# Altium schematic sheet HomeLight_230722.SchDoc
size A3
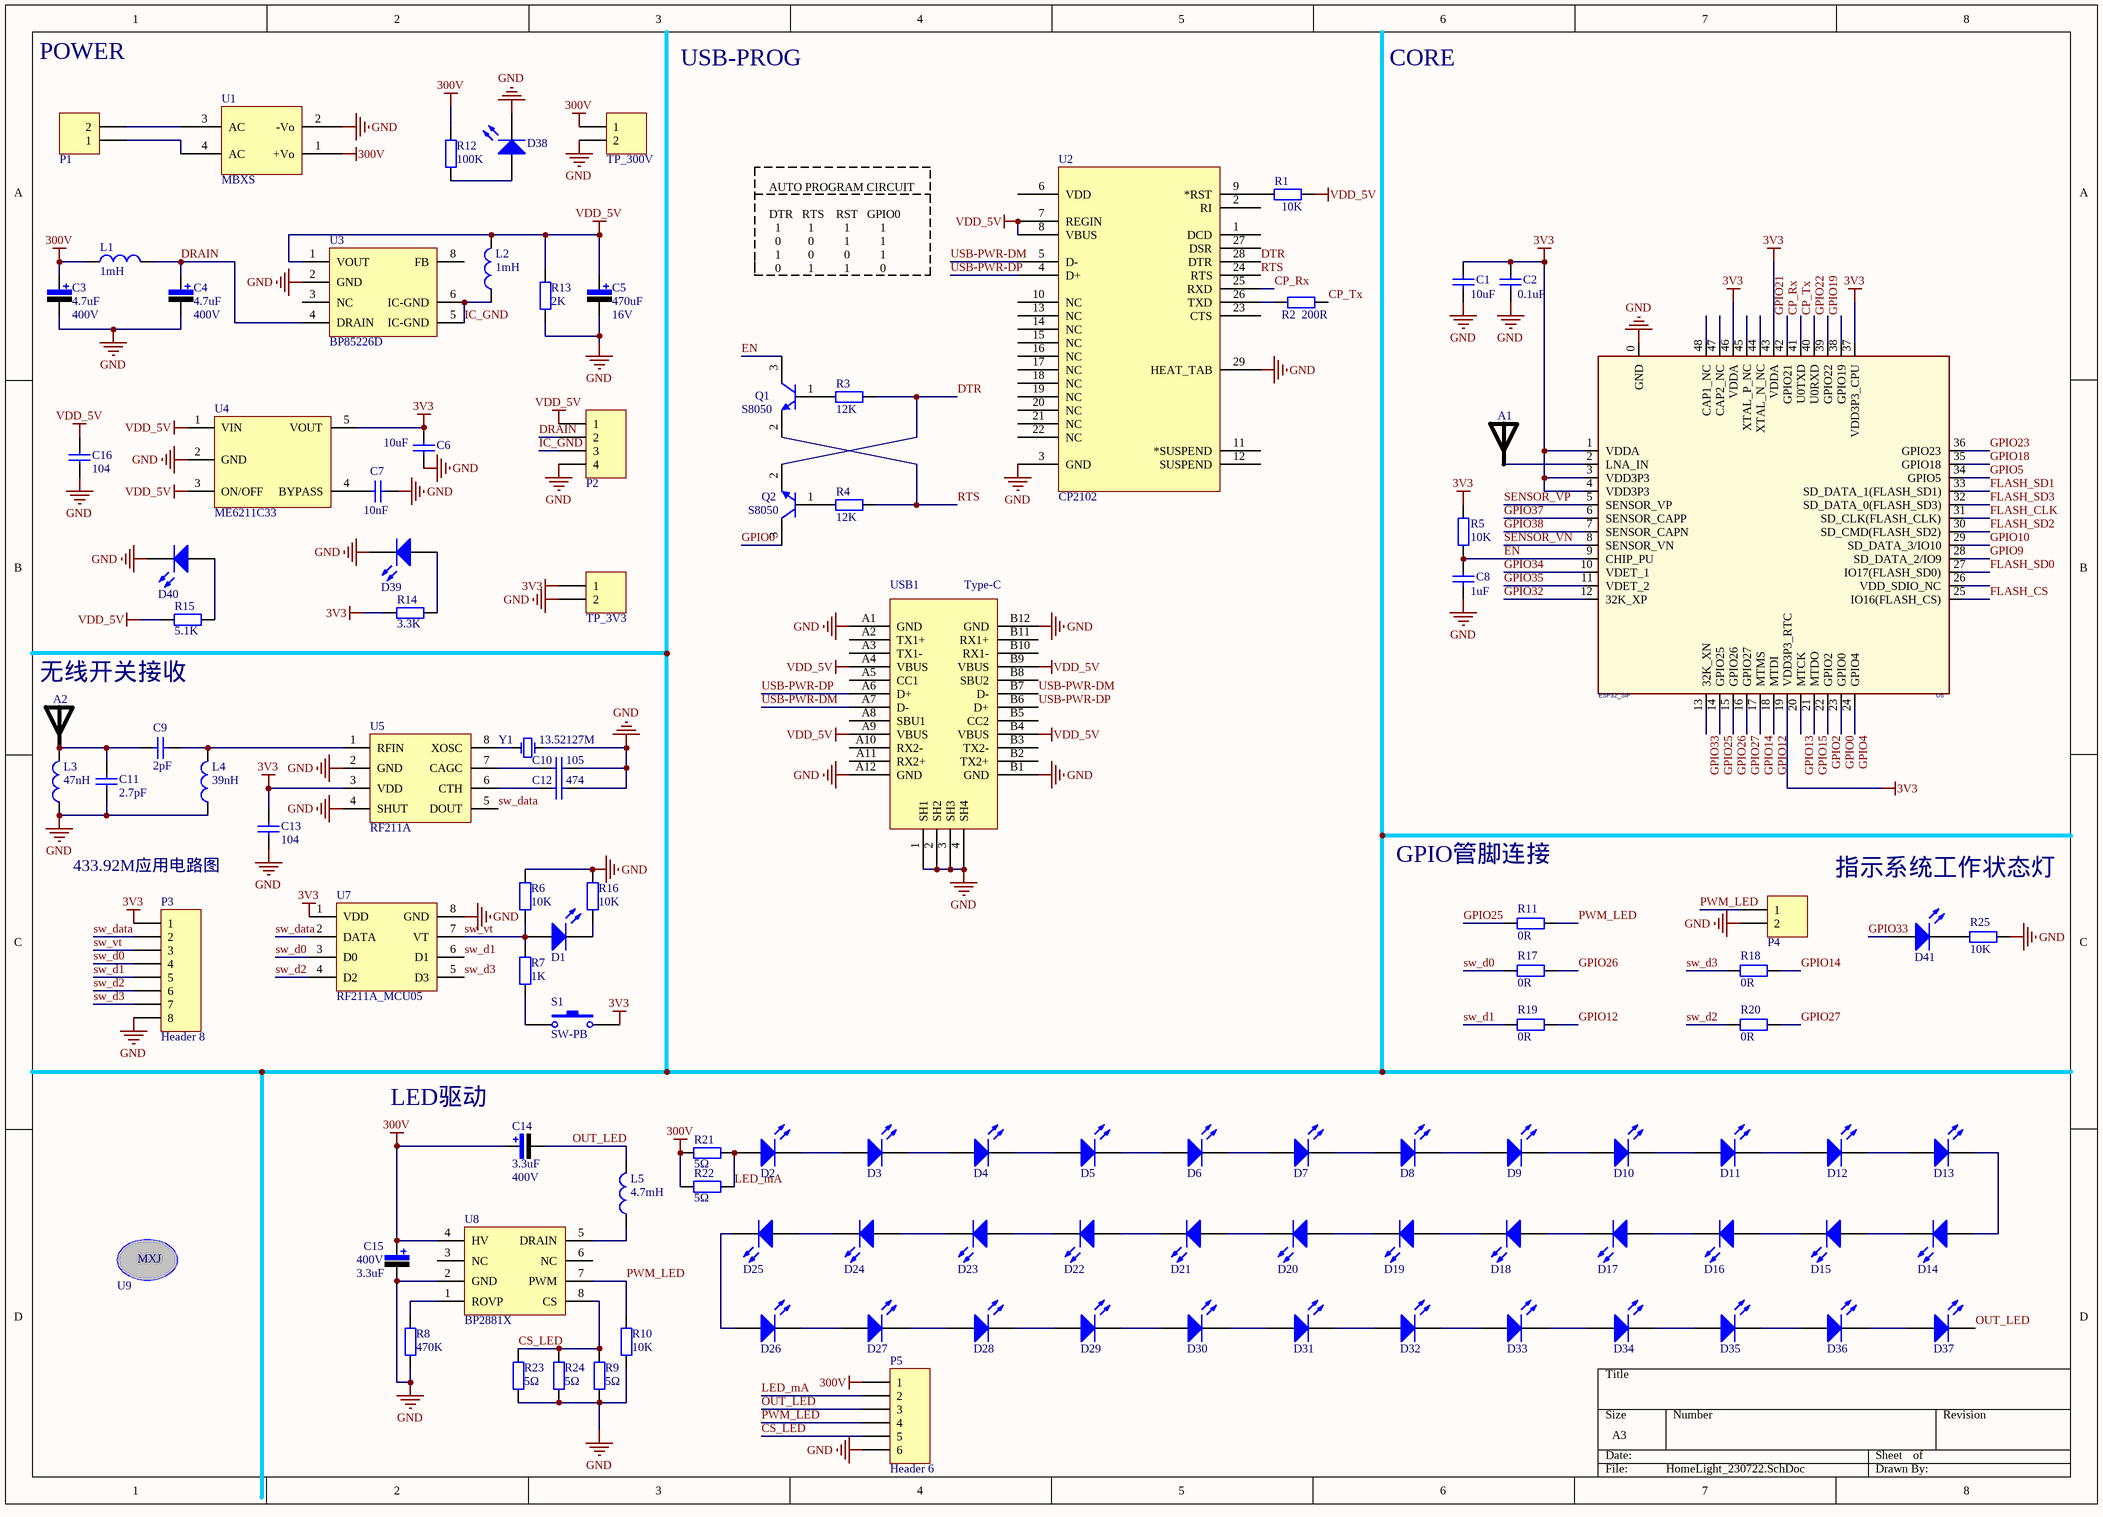
[diagram p0: HomeLight_230722.SchDoc]

## Parts
A1  ANT  [ANT5020R2400]  (value not drawn)
A2  ANT  [ANT15030R433]  (value not drawn)
C1  10uF  [0603-2]
C2  0.1uF  [0603-2]
C3  value 4.7uF  Vol: 400V  [SMD-EC-F8]  (hidden comment: Cap Pol)
C4  value 4.7uF  Vol: 400V  [SMD-EC-F8]  (hidden comment: Cap Pol)
C5  value 470uF  Vol: 16V  [SMD-EC-F8]  (hidden comment: Cap Pol)
C6  10uF  [0603-2]
C7  10nF  [0603-2]
C8  1uF  [0603-2]
C9  value 2pF  [0603-2]  (hidden comment: Cap)
C10  value 105  [0603-2]  (hidden comment: Cap)
C11  value 2.7pF  [0603-2]  (hidden comment: Cap)
C12  value 474  [0603-2]  (hidden comment: Cap)
C13  value 104  [0603-2]  (hidden comment: Cap)
C14  value 3.3uF  Vol: 400V  [SMD-EC-F8]  (hidden comment: Cap Pol)
C15  value 3.3uF  Vol: 400V  [SMD-EC-F8]  (hidden comment: Cap Pol)
C16  value 104  [0603-2]  (hidden comment: Cap)
D1  LED0  [LED_0603]  (value not drawn)
D2  LED0  [LED-5730]  (value not drawn)
D3  LED0  [LED-5730]  (value not drawn)
D4  LED0  [LED-5730]  (value not drawn)
D5  LED0  [LED-5730]  (value not drawn)
D6  LED0  [LED-5730]  (value not drawn)
D7  LED0  [LED-5730]  (value not drawn)
D8  LED0  [LED-5730]  (value not drawn)
D9  LED0  [LED-5730]  (value not drawn)
D10  LED0  [LED-5730]  (value not drawn)
D11  LED0  [LED-5730]  (value not drawn)
D12  LED0  [LED-5730]  (value not drawn)
D13  LED0  [LED-5730]  (value not drawn)
D14  LED0  [LED-5730]  (value not drawn)
D15  LED0  [LED-5730]  (value not drawn)
D16  LED0  [LED-5730]  (value not drawn)
D17  LED0  [LED-5730]  (value not drawn)
D18  LED0  [LED-5730]  (value not drawn)
D19  LED0  [LED-5730]  (value not drawn)
D20  LED0  [LED-5730]  (value not drawn)
D21  LED0  [LED-5730]  (value not drawn)
D22  LED0  [LED-5730]  (value not drawn)
D23  LED0  [LED-5730]  (value not drawn)
D24  LED0  [LED-5730]  (value not drawn)
D25  LED0  [LED-5730]  (value not drawn)
D26  LED0  [LED-5730]  (value not drawn)
D27  LED0  [LED-5730]  (value not drawn)
D28  LED0  [LED-5730]  (value not drawn)
D29  LED0  [LED-5730]  (value not drawn)
D30  LED0  [LED-5730]  (value not drawn)
D31  LED0  [LED-5730]  (value not drawn)
D32  LED0  [LED-5730]  (value not drawn)
D33  LED0  [LED-5730]  (value not drawn)
D34  LED0  [LED-5730]  (value not drawn)
D35  LED0  [LED-5730]  (value not drawn)
D36  LED0  [LED-5730]  (value not drawn)
D37  LED0  [LED-5730]  (value not drawn)
D38  LED0  [LED_0603]  (value not drawn)
D39  LED0  [LED_0603]  (value not drawn)
D40  LED0  [LED_0603]  (value not drawn)
D41  LED0  [LED_0603]  (value not drawn)
L1  value 1mH  [CD54]  (hidden comment: Inductor)
L2  value 1mH  [CD54]  (hidden comment: Inductor)
L3  value 47nH  [0603-1]  (hidden comment: Inductor)
L4  value 39nH  [0603-1]  (hidden comment: Inductor)
L5  value 4.7mH  [CD54]  (hidden comment: Inductor)
P1  Header 2  [HDR2X1_焊接版]  (value not drawn)
P2  Header 4  [HDR4X1_2.54]  (value not drawn)
P3  Header 8  [HDR8X1_2.54]
P4  Header 2  [HDR2X1_2.54]  (value not drawn)
P5  Header 6  [HDR6X1_2.54]
Q1  S8050  [SOT-23]
Q2  S8050  [SOT-23]
R1  10K  [0603-1]
R2  200R  [0603-1]
R3  12K  [0603-1]
R4  12K  [0603-1]
R5  10K  [0603-1]
R6  value 10K  [0603-1]  (hidden comment: Res1)
R7  value 1K  [0603-1]  (hidden comment: Res1)
R8  value 470K  [0603-1]  (hidden comment: Res1)
R9  value 5Ω  [0603-1]  (hidden comment: Res1)
R10  value 10K  [0603-1]  (hidden comment: Res1)
R11  value 0R  [0603-1]  (hidden comment: Res1)
R12  value 100K  [0603-1]  (hidden comment: 12K)
R13  value 2K  [0603-1]  (hidden comment: 12K)
R14  value 3.3K  [0603-1]  (hidden comment: 12K)
R15  value 5.1K  [0603-1]  (hidden comment: 12K)
R16  value 10K  [0603-1]  (hidden comment: Res1)
R17  value 0R  [0603-1]  (hidden comment: Res1)
R18  value 0R  [0603-1]  (hidden comment: Res1)
R19  value 0R  [0603-1]  (hidden comment: Res1)
R20  value 0R  [0603-1]  (hidden comment: Res1)
R21  value 5Ω  [0603-1]  (hidden comment: Res1)
R22  value 5Ω  [0603-1]  (hidden comment: Res1)
R23  value 5Ω  [0603-1]  (hidden comment: Res1)
R24  value 5Ω  [0603-1]  (hidden comment: Res1)
R25  value 10K  [0603-1]  (hidden comment: Res1)
S1  SW-PB  [SW_PB2_A1]
TP_3V3  Header 2  [HDR2X1_2.54]  (value not drawn)
TP_300V  Header 2  [HDR2X1_2.54]  (value not drawn)
U1  MBXS  [MBXS]
U2  CP2102  [QFN-28]
U3  BP85226D  [BP85226-BP2881]
U4  ME6211C33  [SOT23-5]
U5  RF211A  [SOIC-8]
U6  ESP32_SIP  [QFN-48_7X7]
U7  RF211A_MCU05  [SOIC-8]
U8  BP2881X  [BP85226-BP2881]
U9  logo_MXJ  [logo_MXJ]  (value not drawn)
USB1  Type-C  [Type-C-TOP]
Y1  value 13.52127M  [X-SM49]  (hidden comment: XTAL)

## Nets
3V3: C1.2 C2.2 C6.2 C13.1 P3.1 R5.1 R14.2 S1.2 TP_3V3.1 U4.5(VOUT) U5.3(VDD) U6.1(VDDA) U6.3(VDD3P3) U6.4(VDD3P3) U6.19(VDD3P3_RTC) U6.37(VDD3P3_CPU) U6.43(VDDA) U6.46(VDDA) U7.1(VDD)
300V: C3.1 C14.1 C15.1 L1.1 P5.1 R12.2 R21.2 R22.2 TP_300V.1 U1.1(+Vo) U8.4(HV)
GND: C1.1 C2.1 C3.2 C4.2 C5.2 C6.1 C7.1 C8.2 C10.1 C11.2 C12.1 C13.2 C15.2 C16.2 D38.2(K) D39.2(K) D40.2(K) L3.1 L4.1 P2.4 P3.8 P4.2 P5.6 R6.2 R8.1 R9.1 R10.1 R13.2 R16.2 R23.1 R24.1 R25.1 TP_3V3.2 TP_300V.2 U1.2(-Vo) U2.3(GND) U2.29(HEAT_TAB) U3.2(GND) U4.2(GND) U5.2(GND) U5.4(SHUT) U6.0(GND) U7.8(GND) U8.2(GND) USB1.1(SH1) USB1.2(SH2) USB1.3(SH3) USB1.4(SH4) USB1.A1(GND) USB1.A12(GND) USB1.B1(GND) USB1.B12(GND) Y1.2
VDD_5V: C5.1 C16.1 L2.2 P2.1 R1.1 R13.1 R15.2 U2.7(REGIN) U2.8(VBUS) U3.1(VOUT) U4.1(VIN) U4.3(ON/OFF) USB1.A4(VBUS) USB1.A9(VBUS) USB1.B4(VBUS) USB1.B9(VBUS)
CP_Rx: U2.25(RXD) U6.41(U0TXD)
CP_Tx: R2.1 U6.40(U0RXD)
CS_LED: P5.5 R9.2 R23.2 R24.2 U8.8(CS)
DRAIN: C4.1 L1.2 P2.2 U3.4(DRAIN)
DTR: Q2.2(E) R3.1 U2.28(DTR)
EN: C8.1 Q1.3(C) R5.2 U6.9(CHIP_PU)
FLASH_CLK: U6.31(SD_CLK(FLASH_CLK))
FLASH_CS: U6.25(IO16(FLASH_CS))
FLASH_SD0: U6.27(IO17(FLASH_SD0))
FLASH_SD1: U6.33(SD_DATA_1(FLASH_SD1))
FLASH_SD2: U6.30(SD_CMD(FLASH_SD2))
FLASH_SD3: U6.32(SD_DATA_0(FLASH_SD3))
GPIO0: Q2.3(C) U6.23(GPIO0)
GPIO2: U6.22(GPIO2)
GPIO4: U6.24(GPIO4)
GPIO5: U6.34(GPIO5)
GPIO9: U6.28(SD_DATA_2/IO9)
GPIO10: U6.29(SD_DATA_3/IO10)
GPIO12: R19.1 U6.18(MTDI)
GPIO13: U6.20(MTCK)
GPIO14: R18.1 U6.17(MTMS)
GPIO15: U6.21(MTDO)
GPIO18: U6.35(GPIO18)
GPIO19: U6.38(GPIO19)
GPIO21: U6.42(GPIO21)
GPIO22: U6.39(GPIO22)
GPIO23: U6.36(GPIO23)
GPIO25: R11.2 U6.14(GPIO25)
GPIO26: R17.1 U6.15(GPIO26)
GPIO27: R20.1 U6.16(GPIO27)
GPIO32: U6.12(32K_XP)
GPIO33: D41.1(A) U6.13(32K_XN)
GPIO34: U6.10(VDET_1)
GPIO35: U6.11(VDET_2)
GPIO37: U6.6(SENSOR_CAPP)
GPIO38: U6.7(SENSOR_CAPN)
IC_GND: L2.1 P2.3 U3.5(IC-GND) U3.6(IC-GND)
LED_mA: D2.1(A) P5.2 R21.1 R22.1
OUT_LED: C14.2 D37.2(K) L5.2 P5.3
PWM_LED: P4.1 P5.4 R10.2 R11.1 U8.7(PWM)
RTS: Q1.2(E) R4.1 U2.24(RTS)
SENSOR_VN: U6.8(SENSOR_VN)
SENSOR_VP: U6.5(SENSOR_VP)
sw_d0: P3.4 R17.2 U7.3(D0)
sw_d1: P3.5 R19.2 U7.6(D1)
sw_d2: P3.6 R20.2 U7.4(D2)
sw_d3: P3.7 R18.2 U7.5(D3)
sw_data: P3.2 U5.5(DOUT) U7.2(DATA)
sw_vt: D1.1(A) P3.3 R6.1 R7.2 U7.7(VT)
USB-PWR-DM: U2.5(D-) USB1.A7(D-) USB1.B7(D-)
USB-PWR-DP: U2.4(D+) USB1.A6(D+) USB1.B6(D+)
NetA1_1: A1.1 U6.2(LNA_IN)
NetA2_1: A2.1 C9.1 C11.1 L3.2
NetC7_2: C7.2 U4.4(BYPASS)
NetC9_2: C9.2 L4.2 U5.1(RFIN)
NetC10_2: C10.2 U5.7(CAGC)
NetC12_2: C12.2 U5.6(CTH)
NetD1_2: D1.2(K) R16.1
NetD2_2: D2.2(K) D3.1(A)
NetD3_2: D3.2(K) D4.1(A)
NetD4_2: D4.2(K) D5.1(A)
NetD5_2: D5.2(K) D6.1(A)
NetD6_2: D6.2(K) D7.1(A)
NetD7_2: D7.2(K) D8.1(A)
NetD8_2: D8.2(K) D9.1(A)
NetD9_2: D9.2(K) D10.1(A)
NetD10_2: D10.2(K) D11.1(A)
NetD11_2: D11.2(K) D12.1(A)
NetD12_2: D12.2(K) D13.1(A)
NetD13_2: D13.2(K) D14.1(A)
NetD14_2: D14.2(K) D15.1(A)
NetD15_2: D15.2(K) D16.1(A)
NetD16_2: D16.2(K) D17.1(A)
NetD17_2: D17.2(K) D18.1(A)
NetD18_2: D18.2(K) D19.1(A)
NetD19_2: D19.2(K) D20.1(A)
NetD20_2: D20.2(K) D21.1(A)
NetD21_2: D21.2(K) D22.1(A)
NetD22_2: D22.2(K) D23.1(A)
NetD23_2: D23.2(K) D24.1(A)
NetD24_2: D24.2(K) D25.1(A)
NetD25_2: D25.2(K) D26.1(A)
NetD26_2: D26.2(K) D27.1(A)
NetD27_2: D27.2(K) D28.1(A)
NetD28_2: D28.2(K) D29.1(A)
NetD29_2: D29.2(K) D30.1(A)
NetD30_2: D30.2(K) D31.1(A)
NetD31_2: D31.2(K) D32.1(A)
NetD32_2: D32.2(K) D33.1(A)
NetD33_2: D33.2(K) D34.1(A)
NetD34_2: D34.2(K) D35.1(A)
NetD35_2: D35.2(K) D36.1(A)
NetD36_2: D36.2(K) D37.1(A)
NetD38_1: D38.1(A) R12.1
NetD39_1: D39.1(A) R14.1
NetD40_1: D40.1(A) R15.1
NetD41_2: D41.2(K) R25.2
NetL5_1: L5.1 U8.5(DRAIN)
NetP1_1: P1.1 U1.4(AC)
NetP1_2: P1.2 U1.3(AC)
NetQ1_1: Q1.1(B) R3.2
NetQ2_1: Q2.1(B) R4.2
NetR1_2: R1.2 U2.9(*RST)
NetR2_2: R2.2 U2.26(TXD)
NetR7_1: R7.1 S1.1
NetR8_2: R8.2 U8.1(ROVP)
NetU5_8: U5.8(XOSC) Y1.1

Not connected (* = marked no-connect by the designer): U2 1(DCD) 2(RI) 6(VDD) 10(NC) 11(*SUSPEND) 12(SUSPEND) 13(NC) 14(NC) 15(NC) 16(NC) 17(NC) 18(NC) 19(NC) 20(NC) 21(NC) 22(NC) 23(CTS) 27(DSR); U3 3(NC) 8(FB); U6 26(VDD_SDIO_NC) 44(XTAL_N_NC) 45(XTAL_P_NC) 47(CAP2_NC) 48(CAP1_NC); U8 3(NC) 6(NC); USB1 A2(TX1+) A3(TX1-) A5(CC1) A8(SBU1) A10(RX2-) A11(RX2+) B2(TX2+) B3(TX2-) B5(CC2) B8(SBU2) B10(RX1-) B11(RX1+)

## Notes on the sheet
- POWER
- USB-PROG
- CORE
- AUTO PROGRAM CIRCUIT
  DTR   RTS    RST   GPIO0
  1         1          1          1
  0         0          1          1
  1         0          0          1
  0         1          1          0
- 无线开关接收
- 433.92M应用电路图
- GPIO管脚连接
- 指示系统工作状态灯
- LED驱动
- (in symbol logo_MXJ) MXJ

## Library data of the parts
C1 C2 C6-C13 C16 = Cap: 无极性电容; Published: 8-Jun-2000; LatestRevisionDate: 17-Jul-2002; LatestRevisionNote: Re-released for DXP Platform.; PackageReference: RAD-0.3; Publisher: Altium Limited
  C1 C6: Value: 10uF
  C2: Value: 0.1uF
  C7: Value: 10nF
  C8: Value: 1uF
C3-C5 C14 C15 = Cap Pol: 极性电解电容; Published: 8-Jun-2000; LatestRevisionDate: 17-Jul-2002; LatestRevisionNote: Re-released for DXP Platform.; PackageReference: RB7.6-15; Publisher: Altium Limited
D1-D41 = LED0: 发光二极管; Published: 8-Jun-2000; LatestRevisionDate: 08-Jul-2005; LatestRevisionNote: Mech Layer 1 removed.; PackageReference: LED-0; Publisher: Altium Limited
L1-L5 = Inductor: 电感; Code_IEC: 1005; Published: 8-Jun-2000; LatestRevisionDate: 17-Jul-2002; LatestRevisionNote: Re-released for DXP Platform.; PackageReference: 0402-A; Publisher: Altium Limited; Code_JEITA: 0402
P1 P4 TP_3V3 TP_300V = Header 2: 接插件; LatestRevisionDate: 17-Jul-2002; LatestRevisionNote: Re-released for DXP Platform.; Publisher: Altium Limited
P2 = Header 4: 接插件; LatestRevisionDate: 17-Jul-2002; LatestRevisionNote: Re-released for DXP Platform.; Publisher: Altium Limited
P3 = Header 8: Header, 8-Pin; LatestRevisionDate: 17-Jul-2002; LatestRevisionNote: Re-released for DXP Platform.; Publisher: Altium Limited
P5 = Header 6: 接插件; LatestRevisionDate: 17-Jul-2002; LatestRevisionNote: Re-released for DXP Platform.; Publisher: Altium Limited
Q1 Q2 = Triode-NPN: NPN三极管; Published: 8-Jun-2000; LatestRevisionDate: 15-Jan-2003; LatestRevisionNote: PCB Footprint 'BCY-W3/D4.7' replaced; DatasheetDocument: 1997; PackageDocument: Sep-1998; PackageReference: TO-92A; Publisher: Altium Limited; Code_JEDEC: TO-92A; ComponentLink1Description: Manufacturer Link; ComponentLink1URL: http://www.fairchildsemi.com/; ComponentLink2Description: Datasheet; ComponentLink2URL: http://www.fairchildsemi.com/ds/2N%2F2N3904.pdf
R1-R25 = Res1: 贴片电阻; Published: 8-Jun-2000; LatestRevisionDate: 17-Jul-2002; LatestRevisionNote: Re-released for DXP Platform.; PackageReference: AXIAL-0.4; Publisher: Altium Limited
  R1 R5: Value: 10K
  R2: Value: 200R
  R3 R4: Value: 12K
S1 = SW-PB: 微动开关; Published: 24-Mar-1999; LatestRevisionDate: 17-Jul-2002; LatestRevisionNote: Re-released for DXP Platform.; PackageReference: SPST-2; Publisher: Altium Limited
U1 = MBXS: 整流桥
U2 = CP2102: USB转TTL; PART DESC: SINGLE-CHIP USB TO UART BRIDGE, QFN28, RoHS.; MFG #1: SILICON LABS; PART NUMBER: CP2102; Value: Value; RefDes: RefDes; Type: DEV
U3 = BP85226: 开关电源驱动芯片
U4 = LP2992: LDO
U5 = RF211A: 315M无线接收芯片
U6 = ESP32-PICO
U7 = RF211A_MCU05: 无线接收芯片的解码芯片
U8 = BP2881X: PWM调光非隔离降压型LED恒流驱动芯片
USB1 = USB-Type-C-TOP
Y1 = XTAL: 晶振; Published: 8-Jun-2000; LatestRevisionDate: 17-Jul-2002; LatestRevisionNote: Re-released for DXP Platform.; PackageReference: R38; Publisher: Altium Limited